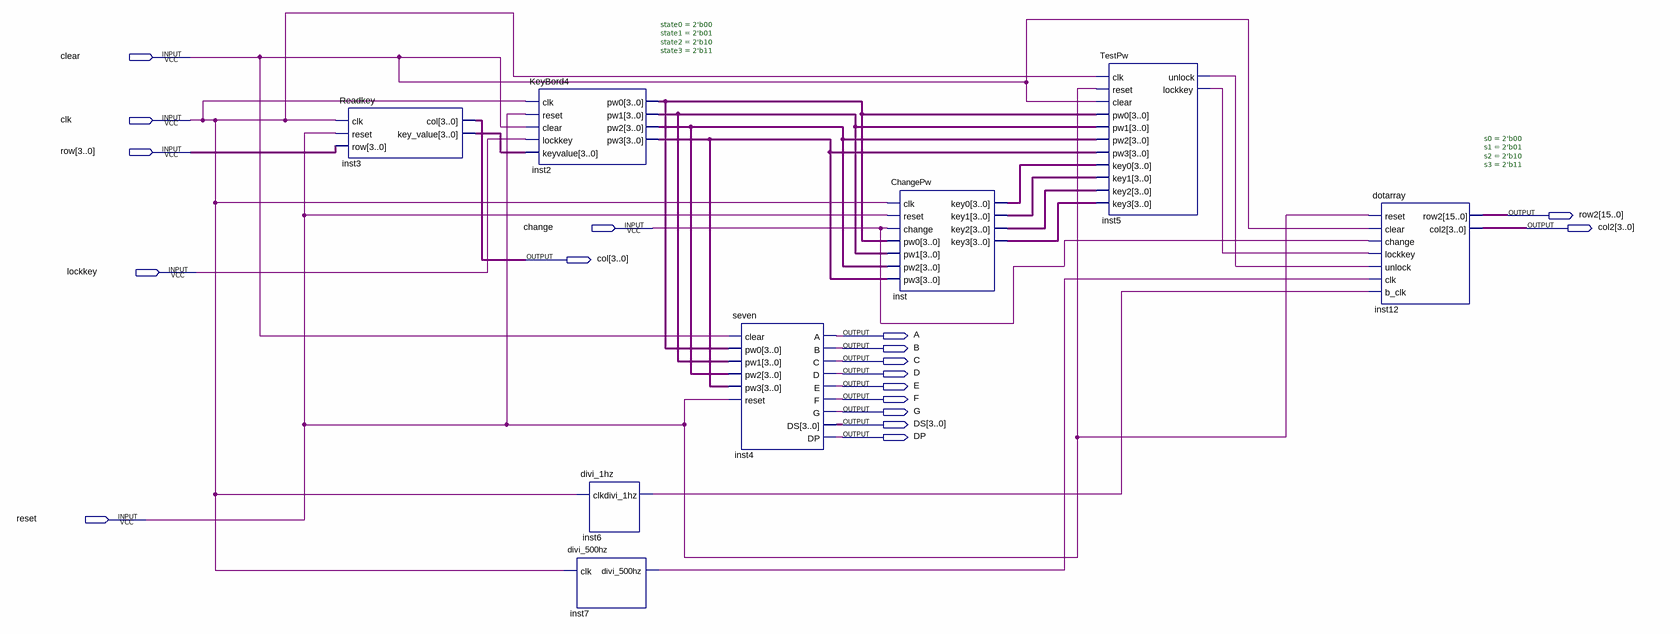
[diagram p0: schematic sheet]
// Quartus schematic TrickLock.bdf as structural Verilog: 8 symbols, 18 pins
module TrickLock (
  input  clear,
  input  clk,
  input  [3:0] row,
  input  change,
  input  lockkey,
  input  reset,
  output [15:0] row2,
  output [3:0] col2,
  output [3:0] col,
  output A,
  output B,
  output C,
  output D,
  output E,
  output F,
  output G,
  output [3:0] DS,
  output DP
);

  wire inst5_lockkey, inst5_unlock, inst6_divi_1hz, inst7_divi_500hz;
  wire [3:0] inst2_pw0, inst2_pw1, inst2_pw2, inst2_pw3, inst3_key_value, inst_key0, inst_key1, inst_key2,
       inst_key3;

  Readkey inst3 (.clk(clk), .reset(reset), .row(row), .col(col), .key_value(inst3_key_value));
  KeyBord4 #(.state0(2'b00), .state1(2'b01), .state2(2'b10), .state3(2'b11)) inst2 (
    .clk(clk), .reset(reset), .clear(clear), .lockkey(lockkey), .keyvalue(inst3_key_value), .pw0(inst2_pw0),
    .pw1(inst2_pw1), .pw2(inst2_pw2), .pw3(inst2_pw3));
  divi_1hz inst6 (.clk(clk), .divi_1hz(inst6_divi_1hz));
  divi_500hz inst7 (.clk(clk), .divi_500hz(inst7_divi_500hz));
  seven inst4 (
    .clear(clear), .pw0(inst2_pw0), .pw1(inst2_pw1), .pw2(inst2_pw2), .pw3(inst2_pw3), .reset(reset), .A(A),
    .B(B), .C(C), .D(D), .E(E), .F(F), .G(G), .DS(DS), .DP(DP));
  ChangePw inst (
    .clk(clk), .reset(reset), .change(change), .pw0(inst2_pw0), .pw1(inst2_pw1), .pw2(inst2_pw2),
    .pw3(inst2_pw3), .key0(inst_key0), .key1(inst_key1), .key2(inst_key2), .key3(inst_key3));
  TestPw inst5 (
    .clk(clk), .reset(reset), .clear(clear), .pw0(inst2_pw0), .pw1(inst2_pw1), .pw2(inst2_pw2),
    .pw3(inst2_pw3), .key0(inst_key0), .key1(inst_key1), .key2(inst_key2), .key3(inst_key3),
    .unlock(inst5_unlock), .lockkey(inst5_lockkey));
  dotarray #(.s0(2'b00), .s1(2'b01), .s2(2'b10), .s3(2'b11)) inst12 (
    .reset(reset), .clear(clear), .change(change), .lockkey(inst5_lockkey), .unlock(inst5_unlock),
    .clk(inst7_divi_500hz), .b_clk(inst6_divi_1hz), .row2(row2), .col2(col2));
endmodule
